# EAGLE design Interface PCB (EAGLE 9.6.2)
DESCRIPTION: microOBD 200 OBD-II Module; HW_REV: 1.4; PCB_REV: C; PCB_SPEC1: Layer Count: 4; PCB_SPEC2: Size: 1.3" x 0.59"; PCB_SPEC3: Finish Thickness: 0.049" - 0.052"; PCB_SPEC4: Copper Weight: 1oz; TITLE: STM1120
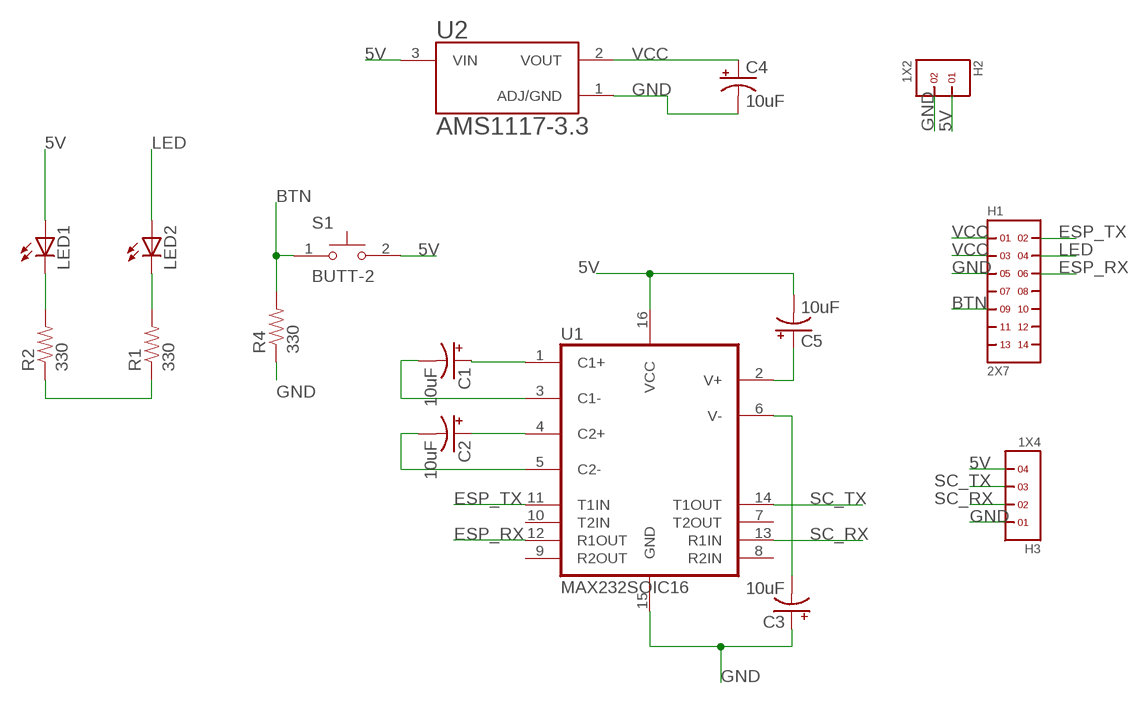
[diagram p0: schematic, sheet 1]

## Parts
C1  10uF  10UF-16V-10%(TANT)  [EIA3216]
C2  10uF  10UF-16V-10%(TANT)  [EIA3216]
C3  10uF  10UF-16V-10%(TANT)  [EIA3216]
C4  10uF  10UF-16V-10%(TANT)  [EIA3216]
C5  10uF  10UF-16V-10%(TANT)  [EIA3216]
H1  2X7  [2X7]
H2  1X2  [1X2]
H3  1X4  [1X4]
LED1  LED5MM  [LED5MM]
LED2  LED5MM  [LED5MM]
R1  330  RESISTOR0402-RES  [0402-RES]
R2  330  RESISTOR0402-RES  [0402-RES]
R4  330  RESISTOR0402-RES  [0402-RES]
S1  BUTT-2  [SW_BUTT-2]
U1  MAX232SOIC16  [SO016]
U2  AMS1117-3.3  [SOT229P700X180-4N]

## Nets
5V: C5.C(-) H2.1 H3.4 LED1.A S1.2 U1.16(VCC) U2.3(VIN)
BTN: H1.9 R4.2 S1.1
ESP_RX: H1.6 U1.12(R1OUT)
ESP_TX: H1.2 U1.11(T1IN)
GND: C3.A(+) C4.C(-) H1.5 H2.2 H3.1 R4.1 U1.15(GND) U2.1(ADJ/GND)
LED: H1.4 LED2.A
N$1: C1.A(+) U1.1(C1+)
N$2: C1.C(-) U1.3(C1-)
N$3: C2.A(+) U1.4(C2+)
N$4: C2.C(-) U1.5(C2-)
N$5: C3.C(-) U1.6(V-)
N$6: C5.A(+) U1.2(V+)
N$7: LED1.K(C) R2.2
N$8: LED2.K(C) R1.2
N$9: R1.1 R2.1
SC_RX: H3.2 U1.13(R1IN)
SC_TX: H3.3 U1.14(T1OUT)
VCC: C4.A(+) H1.1 H1.3 U2.2(VOUT)
Unconnected: H1.7 H1.8 H1.10 H1.11 H1.12 H1.13 H1.14 U1.7(T2OUT) U1.8(R2IN) U1.9(R2OUT) U1.10(T2IN)

## Library data of the parts
C1-C5 = SparkFun-Capacitors:10UF-16V-10%(TANT): CAP-00811 1206/EIA-3216 Tantalum capacitor; PROD_ID: CAP-00811
H1 = headers(.1in):2X7
H2 = headers(.1in):1X2
H3 = headers(.1in):1X4
LED1 LED2 = SparkFun-LED:LED: LEDs Standard schematic elements and footprints for 5mm, 3mm, 1206, and 0603 sized LEDs. 5mm - Spark Fun Electronics SKU : COM-00529 (and others)
R1 R2 R4 = SparkFun:RESISTOR: Resistor Basic schematic elements and footprints for 0603, 1206, and PTH resistors.
S1 = BUTT-2:BUTT-2: Tactile Switches MINI PUSH BUTTON SWITCH 2-PIN QTY. 4 Check availability <https://pricing.snapeda.com/parts/BUTT-2/Gravitech/view-part?ref=eda>; AVAILABILITY: In Stock; DESCRIPTION: Tactile Switches MINI PUSH BUTTON SWITCH 2-PIN QTY. 4; MF: Gravitech; MP: BUTT-2; PACKAGE: None; PRICE: None; PURCHASE-URL: https://pricing.snapeda.com/search/part/BUTT-2/?ref=eda
U1 = SparkFun:MAX232: RS232 Transceiver Very common IC. This is generically called 'MAX232', but works with the 3V equivalent MAX3232 generic ICs. Field tested and mother approved. Spark Fun Electronics SKU : COM-00316 (DIP) and COM-00589 (SMD)
U2 = AMS1117-3.3:AMS1117-3.3: Sot223/Pkg 1-Amp 3.3-Volt Low Drop Out Voltage Regulatator Check availability <https://pricing.snapeda.com/parts/AMS1117-3.3/Advanced%20Monolithic%20Systems/view-part?ref=eda>; AVAILABILITY: Not in stock; DESCRIPTION: Sot223/Pkg 1-Amp 3.3-Volt Low Drop Out Voltage Regulatator; MF: Advanced Monolithic Systems; MP: AMS1117-3.3; PACKAGE: SOT-223 Seeed Technology; PRICE: None

## Board
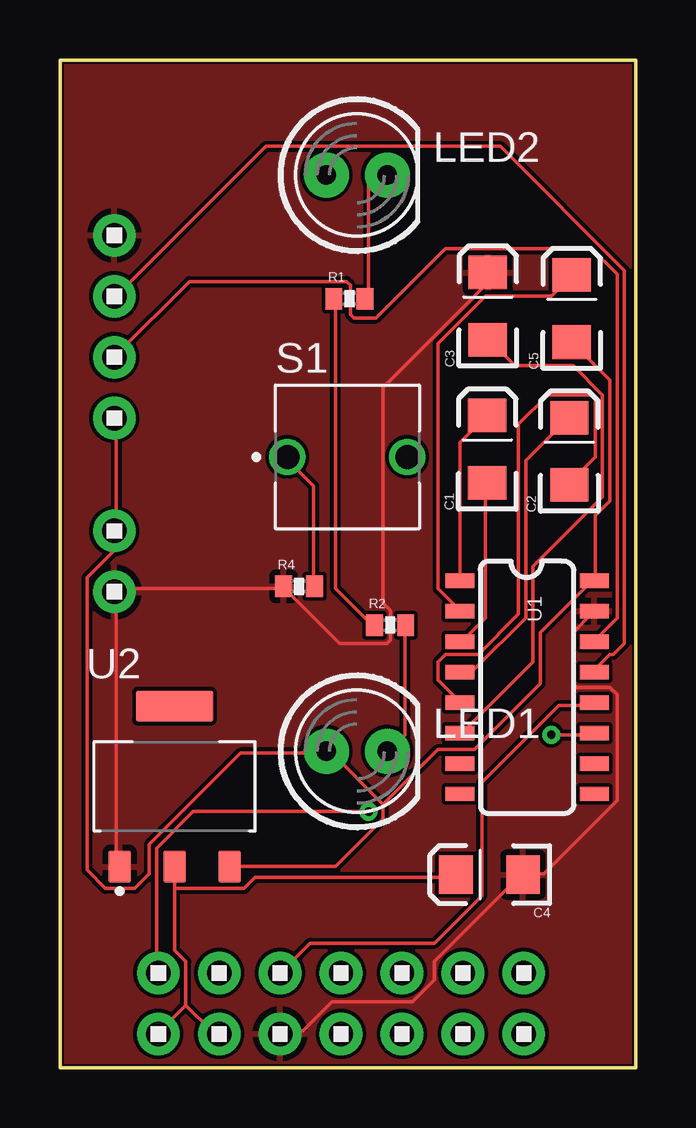
[diagram p1: board, top side]
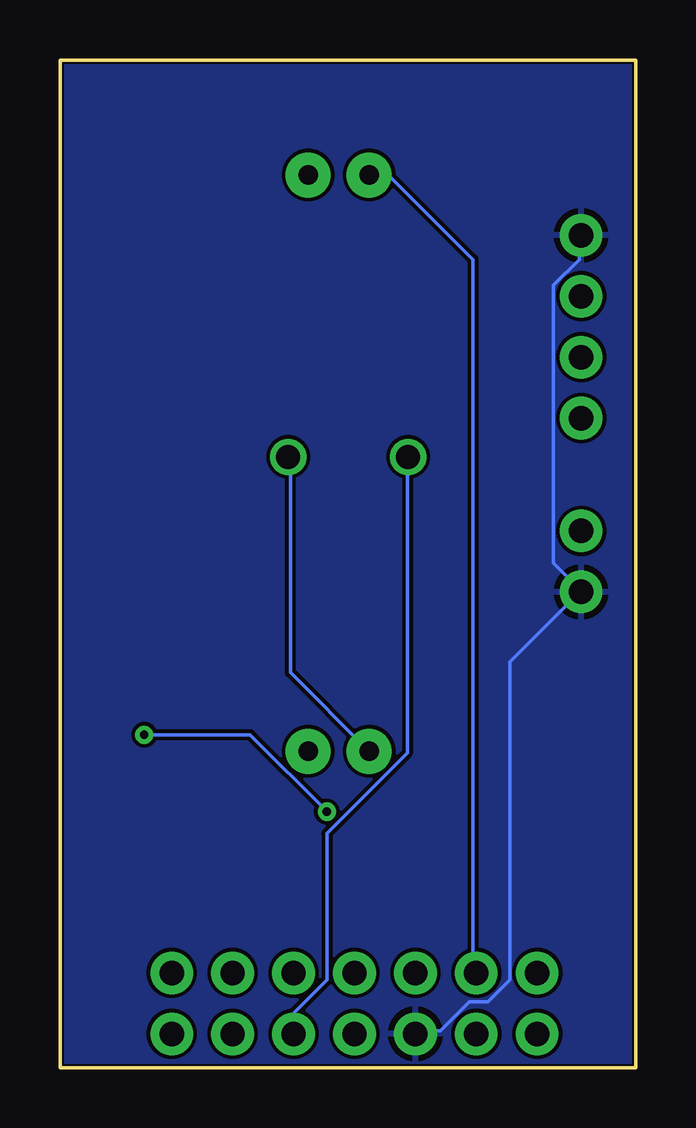
[diagram p2: board, bottom side, seen from below]

Size 24 x 42 mm. Coordinates in mm from the lower left corner, seen from the top.
Outline: 0,0 24,0 24,42 0,42 0,0
Copper layers (1*16): Top 0.035mm / dielectric 1.5mm / Bottom 0.035mm
Design rules "default *": minimum track width 6mil, minimum drill 0.35mm, track to track 6mil, track to pad 6mil, pad to pad 6mil, via to via 6mil, smd to smd 6mil, copper to edge 6mil, drill to drill 6mil, minimum pad ring 10mil, minimum via ring 8mil, stop-mask expansion 4mil, vias tented up to drill 0mil, thermal gap 10mil
Milling: 4 lines

### Footprints (pad centres in the part's own frame; a part is rotated, then mirrored left to right if it is on the bottom)
EIA3216 = smd 1.4 x 1.6: A 1.4,0; C -1.4,0
2X7 = drill 1.016 pad 1.778: 1 0,0; 2 0,2.54; 3 2.54,0; 4 2.54,2.54; 5 5.08,0; 6 5.08,2.54; 7 7.62,0; 8 7.62,2.54; 9 10.16,0; 10 10.16,2.54; 11 12.7,0; 12 12.7,2.54; 13 15.24,0; 14 15.24,2.54
1X2 = drill 1.016 pad 1.778: 1 0,0; 2 2.54,0
1X4 = drill 1.016 pad 1.778: 1 0,0; 2 2.54,0; 3 5.08,0; 4 7.62,0
LED5MM = drill 0.813 pad 1.88: A -1.27,0; K 1.27,0
0402-RES = smd 0.7 x 0.9: 1 -0.65,0; 2 0.65,0
SW_BUTT-2 = drill 1: 1 -2.5,0; 2 2.5,0
SO016 = smd 0.6 x 1.2: 1 -4.445,-2.8; 2 -3.175,-2.8; 3 -1.905,-2.8; 4 -0.635,-2.8; 5 0.635,-2.8; 6 1.905,-2.8; 7 3.175,-2.8; 8 4.445,-2.8; 9 4.445,2.8; 10 3.175,2.8; 11 1.905,2.8; 12 0.635,2.8; 13 -0.635,2.8; 14 -1.905,2.8; 15 -3.175,2.8; 16 -4.445,2.8
SOT229P700X180-4N = smd 0.93 x 1.31: 1 -2.29,-3.345; 2 0,-3.345; 3 2.29,-3.345 | smd 3.24 x 1.31: 4 0,3.345

### Placement (x,y rotation side)
C1  17.82,25.78 90 top
C2  21.24,25.69 90 top
C3  17.84,31.74 90 top
C4  17.91,8.04 180 top
C5  21.34,31.64 90 top
H1  4.1,1.4 0 top
H2  2.27,22.37 270 top
H3  2.27,34.69 270 top
LED1  12.38,13.18 0 top
LED2  12.38,37.2 0 top
R1  12.07,32.05 0 top
R2  13.77,18.44 0 top
R4  9.97,20.06 0 top
S1  11.98,25.45 0 top
U1  19.48,15.85 270 top
U2  4.78,11.72 0 top

### Tracks (layer width: path | path; a pad name or v marks a point on that pad's centre or on a via)
5V
  Top 0.152: H3.4 2.35,26.98 2.35,22.4 H2.1 2.2,22.25 2.2,21.49 1.13,20.42 1.13,8.23 1.9,7.47 3.12,7.47 3.72,8.08 3.72,9.3 7.53,13.11 11.04,13.11 LED1.A 11.19,13.26 13.48,10.97 | C5.C 21.4,30.18 22.93,28.65 22.93,23.62 22.32,23.01 22.32,20.42 U1.16 22.16,20.27 20.03,18.14 20.03,16 17.29,13.26 15.76,13.26 13.48,10.97 | 13.48,10.97 13.48,10.36 11.5,8.38 U2.3
  Bottom 0.152: S1.2 14.39,25.3 14.39,16.46 11.19,13.26 LED1.A
BTN
  Top 0.152: R4.2 10.58,20.12 10.58,24.23 9.52,25.3 S1.1
  Bottom 0.152: H1.9 14.24,1.52 14.24,2.29 12.87,3.66 12.87,9.75 9.52,13.11 9.52,25.3 S1.1
ESP_RX
  Top 0.152: U1.12 22.16,15.09 20.79,15.09 17.59,11.89 17.59,7.16 15.61,5.18 10.43,5.18 9.21,3.96 H1.6
ESP_TX  (via drill 0.35)
  Top 0.152: v20.49,13.87 22.16,13.87 U1.11 | v12.87,10.67 5.55,10.67 4.03,9.14 4.03,3.96 H1.2
  Bottom 0.152: v20.49,13.87 16.07,13.87 v12.87,10.67
GND
  Top 0.152: U1.15 22.16,18.9 21.4,18.14 21.4,16 21.55,15.85 22.93,15.85 23.23,15.54 23.23,11.12 20.18,8.08 19.42,8.08 C4.C 19.27,8.08 15.61,4.42 15.61,3.66 14.7,2.74 11.34,2.74 10.12,1.52 9.21,1.52 H1.5 | U2.1 2.35,8.38 2.35,19.81 H2.2 2.35,19.96 9.21,19.96 R4.1 9.36,19.96 11.65,17.68 13.63,17.68 13.78,17.83 13.78,19.05 13.48,19.36 13.48,28.35 17.75,32.61 17.75,33.07 C3.A
  Bottom 0.152: H3.1 2.35,34.59 2.35,33.68 3.42,32.61 3.42,21.03 2.35,19.96 H2.2 2.35,19.81 5.25,16.92 5.25,3.66 6.16,2.74 6.92,2.74 8.14,1.52 9.06,1.52 H1.5
  pour Top: -1,43 25,43 26,42 26,17 26,-1 -1,-1 -2,0 -2,42
  pour Bottom: -1,44 26,44 26,-1 25,-2 -2,-2 -3,-1 -3,42
LED
  Bottom 0.152: H1.4 6.77,3.96 6.77,33.68 10.28,37.19 LED2.A
N$1
  Top 0.152: U1.1 16.68,20.42 16.68,26.06 17.75,27.13 C1.A
N$2
  Top 0.152: U1.3 16.83,17.83 17.75,18.75 17.75,24.23 C1.C
N$3
  Top 0.152: U1.4 16.83,16.61 17.29,16.61 19.42,18.75 19.42,25.3 21.1,26.98 C2.A
N$4
  Top 0.152: U1.5 16.68,15.24 15.76,16.15 15.76,16.92 16.07,17.22 17.44,17.22 19.12,18.9 19.12,26.82 20.34,28.04 22.16,28.04 22.32,27.89 22.32,25.45 21.25,24.38 C2.C
N$5
  Top 0.152: U1.6 16.83,14.02 19.73,16.92 19.73,20.88 22.62,23.77 22.62,28.04 21.4,29.26 18.96,29.26 17.9,30.33 C3.C
N$6
  Top 0.152: U1.2 16.68,19.05 15.76,19.96 15.76,30.18 17.75,32.16 20.49,32.16 21.25,32.92 C5.A
N$7
  Top 0.152: R2.2 14.39,18.29 14.39,13.87 13.78,13.26 LED1.K
N$8
  Top 0.152: R1.2 12.87,32.16 12.87,37.19 LED2.K
N$9
  Top 0.152: R1.1 11.5,32 11.5,19.96 13.02,18.44 R2.1
SC_RX
  Top 0.152: U1.13 22.32,16.61 22.93,17.22 23.08,17.22 23.54,17.68 23.54,33.22 18.36,38.41 8.6,38.41 2.35,32.16 H3.2
SC_TX
  Top 0.152: U1.14 22.32,17.83 23.23,18.75 23.23,33.07 22.16,34.14 16.07,34.14 13.17,31.24 12.26,31.24 12.11,31.39 12.11,32.61 11.95,32.77 5.4,32.77 2.35,29.72 H3.3
VCC
  Top 0.152: 4.79,7.47 4.79,4.88 5.25,4.42 5.25,2.59 | 4.79,7.47 4.79,8.23 U2.2 | 5.25,2.59 4.18,1.52 H1.1 | 4.79,7.47 7.69,7.47 8.14,7.92 16.37,7.92 C4.A | 5.25,2.59 6.32,1.52 6.62,1.52 H1.3